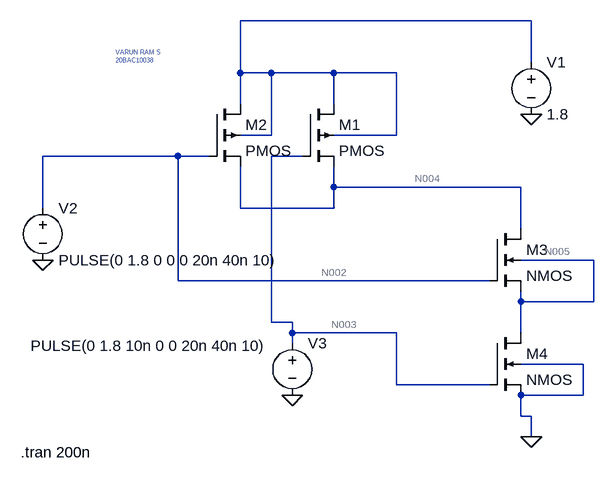
[diagram p0: schematic ECE3006_Exp6_10032023.asc]
ECE3006_Exp6_10032023.asc, the LTspice schematic file:
Version 4
SHEET 1 880 680
WIRE 544 -128 96 -128
WIRE 544 -64 544 -128
WIRE 96 -48 96 -128
WIRE 144 -48 96 -48
WIRE 240 -48 144 -48
WIRE 336 -48 240 -48
WIRE 96 0 96 -48
WIRE 240 0 240 -48
WIRE 144 48 144 -48
WIRE 144 48 96 48
WIRE 336 48 336 -48
WIRE 336 48 240 48
WIRE 0 80 -208 80
WIRE 48 80 0 80
WIRE 192 80 144 80
WIRE 240 128 240 96
WIRE 528 128 240 128
WIRE -208 160 -208 80
WIRE 96 160 96 96
WIRE 240 160 240 128
WIRE 240 160 96 160
WIRE 528 192 528 128
WIRE 640 240 528 240
WIRE 0 272 0 80
WIRE 480 272 0 272
WIRE 528 304 528 288
WIRE 640 304 640 240
WIRE 640 304 528 304
WIRE 144 336 144 80
WIRE 176 336 144 336
WIRE 176 352 176 336
WIRE 336 352 176 352
WIRE 528 352 528 304
WIRE 176 368 176 352
WIRE 624 400 528 400
WIRE 336 432 336 352
WIRE 480 432 336 432
WIRE 624 448 624 400
WIRE 624 448 528 448
WIRE 528 480 528 448
WIRE 544 480 528 480
WIRE 544 512 544 480
FLAG 544 16 0
FLAG -208 240 0
FLAG 176 448 0
FLAG 544 512 0
SYMBOL voltage 544 -80 R0
WINDOW 123 0 0 Left 0
WINDOW 39 0 0 Left 0
SYMATTR InstName V1
SYMATTR Value 1.8
SYMBOL voltage -208 144 R0
WINDOW 123 0 0 Left 0
WINDOW 39 0 0 Left 0
SYMATTR InstName V2
SYMATTR Value PULSE(0 1.8 0 0 0 20n 40n 10)
SYMBOL voltage 176 352 R0
WINDOW 3 -403 20 Left 2
WINDOW 123 0 0 Left 0
WINDOW 39 0 0 Left 0
SYMATTR InstName V3
SYMATTR Value PULSE(0 1.8 10n 0 0 20n 40n 10)
SYMBOL pmos4 192 0 R0
SYMATTR InstName M1
SYMATTR Value2 l=180n w=4u
SYMBOL pmos4 48 0 R0
SYMATTR InstName M2
SYMATTR Value2 l=180n w=4u
SYMBOL nmos4 480 192 R0
SYMATTR InstName M3
SYMATTR Value2 l=180n w=2u
SYMBOL nmos4 480 352 R0
SYMATTR InstName M4
TEXT -96 -80 Left 0 ;VARUN RAM S\n20BAC10038
TEXT -242 536 Left 2 !.tran 200n

The netlist it stands for:
* ECE3006_Exp6_10032023.asc
V1 N001 0 1.8
V2 N002 0 PULSE(0 1.8 0 0 0 20n 40n 10)
V3 N003 0 PULSE(0 1.8 10n 0 0 20n 40n 10)
M1 N001 N003 N004 N001 PMOS l=180n w=4u
M2 N001 N002 N004 N001 PMOS l=180n w=4u
M3 N004 N002 N005 N005 NMOS l=180n w=2u
M4 N005 N003 0 0 NMOS
.model NMOS NMOS
.model PMOS PMOS
.lib standard.mos
* VARUN RAM S
* 20BAC10038
.tran 200n
.backanno
.end

* Results of the author's LTspice run, read from the files saved beside the schematic
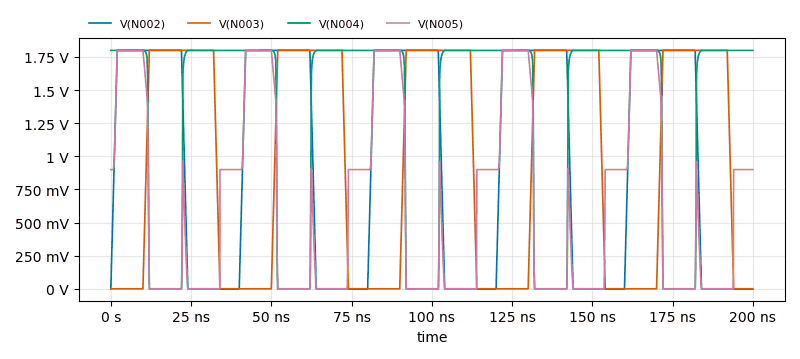
[diagram p1: Transient Analysis of ECE3006_Exp6_10032023.asc, plotted from the saved traces]
* Transient Analysis, 1 run:
*   V(N002): min 0 V, max 1.8 V, average 990 mV, rms 1.315 V, last 0 V
*   V(N003): min 0 V, max 1.8 V, average 990 mV, rms 1.322 V, last 0 V
*   V(N004): min 0 V, max 1.8 V, average 1.32 V, rms 1.536 V, last 1.8 V
*   V(N005): min 0 V, max 1.799 V, average 640.2 mV, rms 976.7 mV, last 900 mV